# EAGLE design Step_Down (EAGLE 8.2.2)
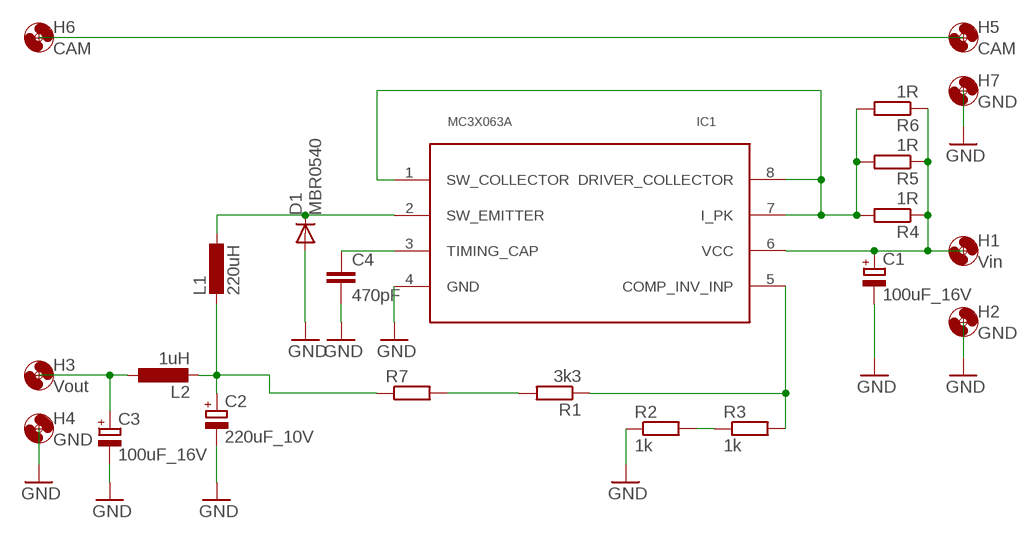
[diagram p0: schematic, sheet 1]

## Parts
C1  100uF_16V  CPOL-EUD/7343-31W  [D/7343-31W]
C2  220uF_10V  CPOL-EUD/7343-31W  [D/7343-31W]
C3  100uF_16V  CPOL-EUD/7343-31W  [D/7343-31W]
C4  470pF  C-EUC0805K  [C0805K]
D1  MBR0540  CGRM4001-G  [SOD-123_MINI-SMA]
H1  Vin  MOUNT-HOLE2.8  [2,8]
H2  GND  MOUNT-HOLE2.8  [2,8]
H3  Vout  MOUNT-HOLE2.8  [2,8]
H4  GND  MOUNT-HOLE2.8  [2,8]
H5  CAM  MOUNT-HOLE2.8  [2,8]
H6  CAM  MOUNT-HOLE2.8  [2,8]
H7  GND  MOUNT-HOLE2.8  [2,8]
IC1  MC3X063A  [SO08]
L1  220uH  L-SMD-2220  [2220]
L2  1uH  L-EUL1812  [L1812]
R1  3k3  R-EU_R0805  [R0805]
R2  1k  R-EU_R0805  [R0805]
R3  1k  R-EU_R0805  [R0805]
R4  1R  R-EU_R0805  [R0805]
R5  1R  R-EU_R0805  [R0805]
R6  1R  R-EU_R0805  [R0805]
R7  R-EU_R1206W  [R1206W]

## Nets
GND: C1.- C2.- C3.- C4.2 D1.A H2.P$1 H4.P$1 H7.P$1 IC1.4(GND) R2.1
N$1: R2.2 R3.1
N$2: IC1.1(SW_COLLECTOR) IC1.7(I_PK) IC1.8(DRIVER_COLLECTOR) R4.2 R5.2 R6.2
N$3: C1.+ H1.P$1 IC1.6(VCC) R4.1 R5.1 R6.1
N$4: D1.C IC1.2(SW_EMITTER) L1.1
N$5: C4.1 IC1.3(TIMING_CAP)
N$6: C2.+ L1.2 L2.2 R7.1
N$7: H5.P$1 H6.P$1
N$8: IC1.5(COMP_INV_INP) R1.1 R3.2
N$9: C3.+ H3.P$1 L2.1
N$10: R1.2 R7.2

## Library data of the parts
C1-C3 = rcl:CPOL-EU: POLARIZED CAPACITOR, European symbol
C4 = rcl:C-EU: CAPACITOR, European symbol
D1 = diode:CGRM400*-G: Molded plasitc,JEDEC SOD-123/Mini SMA Source: Comchip CGRM4001-G.pdf
H1-H7 = holes:MOUNT-HOLE: MOUNTING HOLE with drill center marker
IC1 = usb:MC3X063A
L1 = usb:L-SMD
L2 = rcl:L-EU: INDUCTOR, European symbol
R1-R7 = rcl:R-EU_: RESISTOR, European symbol

## Board
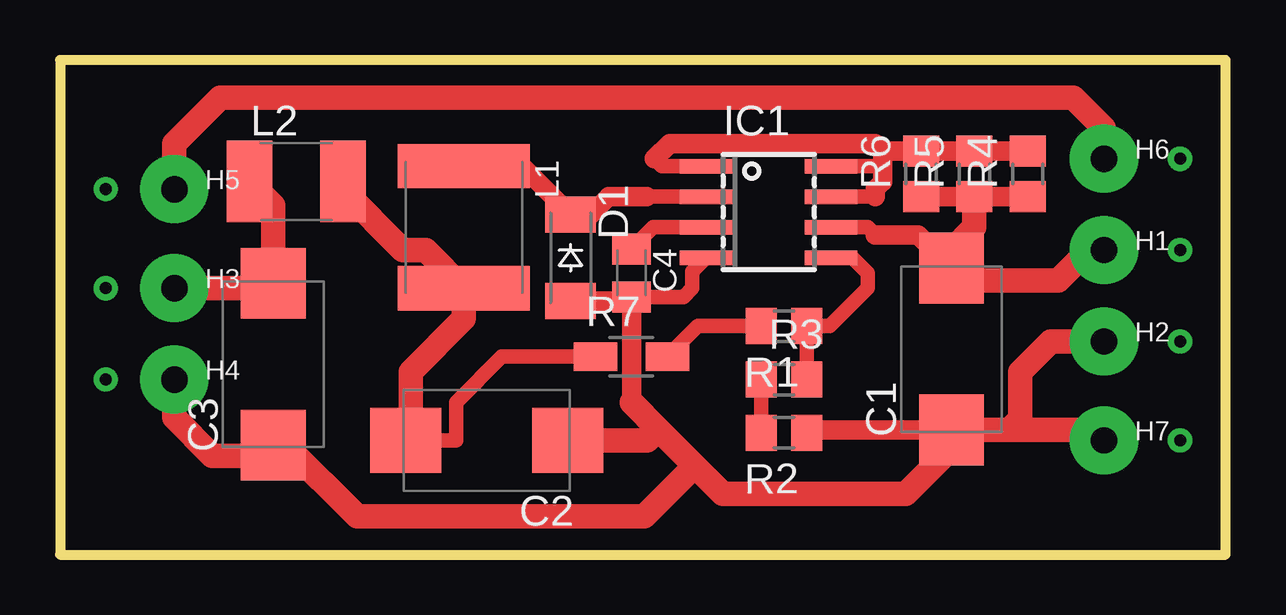
[diagram p1: board, top side]

Size 48.56 x 20.63 mm. Coordinates in mm from the lower left corner, seen from the top.
Outline: 0,0 48.56,0 48.56,20.63 0,20.63 0,0
Copper layers (1*16): Top 0.035mm / dielectric 1.5mm / Bottom 0.035mm
Design rules "default": minimum track width 6mil, minimum drill 0.35mm, track to track 6mil, track to pad 6mil, pad to pad 6mil, via to via 6mil, smd to smd 6mil, copper to edge 40mil, drill to drill 6mil, minimum pad ring 10mil, minimum via ring 8mil, stop-mask expansion 4mil, vias tented up to drill 0mil, thermal gap 10mil

### Footprints (pad centres in the part's own frame; a part is rotated, then mirrored left to right if it is on the bottom)
D/7343-31W = smd 2.95 x 2.7: + 3.375,0; - -3.375,0
C0805K = smd 1.3 x 1.6: 1 -1,0; 2 1,0
SOD-123_MINI-SMA = smd 1.5 x 2.1: A 1.8,0; C -1.8,0
2,8 = drill 1.1 pad 2.845: P$1 0,0
SO08 = smd 0.6 x 2.2: 1 -1.905,-2.6; 2 -0.635,-2.6; 3 0.635,-2.6; 4 1.905,-2.6; 5 1.905,2.6; 6 0.635,2.6; 7 -0.635,2.6; 8 -1.905,2.6
2220 = smd 1.85 x 5.5: 1 -2.55,0; 2 2.55,0
L1812 = smd 1.9 x 3.4: 1 -1.95,0; 2 1.95,0
R0805 = smd 1.3 x 1.5: 1 -0.95,0; 2 0.95,0
R1206W = smd 1.8 x 1.2: 1 -1.499,0; 2 1.499,0

### Placement (x,y rotation side)
C1  37.15,8.57 90 top
C2  17.78,4.76 180 top
C3  8.89,7.94 90 top
C4  23.81,11.75 270 top
D1  21.27,12.38 270 top
H1  43.5,12.7 0 top
H2  43.5,8.89 0 top
H3  4.76,11.11 0 top
H4  4.76,7.3 0 top
H5  4.76,15.24 0 top
H6  43.5,16.51 0 top
H7  43.5,4.76 0 top
IC1  29.53,14.29 270 top
L1  16.83,13.65 270 top
L2  9.84,15.56 0 top
R1  30.16,9.53 180 top
R2  30.16,5.08 180 top
R3  30.16,7.3 0 top
R4  40.32,15.88 90 top
R5  38.1,15.88 90 top
R6  35.88,15.88 90 top
R7  23.81,8.26 0 top

### Tracks (layer width: path | path; a pad name or v marks a point on that pad's centre or on a via)
GND
  Top 0.61: C4.2 25.99,10.75 26.35,11.11 26.35,11.81 IC1.4 | 37.03,5.08 C1.-
  Top 0.813: C1.- 31.23,5.2 R2.1 | 23.81,6.35 C4.2 23.65,10.58 D1.A
  Top 1.016: 26.46,3.71 24.94,5.22 | 26.46,3.71 27.62,2.54 35.24,2.54 37.15,4.45 C1.- 39.55,5.2 | 24.94,5.22 23.81,6.35 | C2.- 24.47,4.76 24.94,5.22 | 26.46,3.71 24.34,1.59 12.38,1.59 9.41,4.56 C3.- 8.46,4.13 6.35,4.13 4.76,5.71 H4.P$1 | 39.55,5.2 43.06,5.2 H7.P$1 | H2.P$1 41.27,8.89 40.01,7.62 40.01,5.65 39.55,5.2
N$1
  Top 0.61: R3.1 R2.2
N$2
  Top 0.61: IC1.7 33.97,14.92 | 24.77,16.51 25.08,16.19 IC1.1 | IC1.8 34.23,16.19 34.29,16.13
  Top 0.813: 33.97,14.92 33.97,15.24 34.29,15.56 34.29,16.13 34.29,16.62 | 34.29,16.62 34.29,16.83 33.97,17.14 25.4,17.14 24.77,16.51 | R4.2 R5.2 R6.2 34.49,16.82 34.29,16.62
N$3
  Top 0.61: IC1.6 33.66,13.65 33.97,13.34
  Top 0.813: 33.97,13.34 35.76,13.34 C1.+ 37.15,13.02 | R5.1 R6.1 | R5.1 R4.1 | R5.1 38.1,14.61
  Top 1.016: R5.1 38.1,13.65 37.15,12.7 C1.+ 37.66,11.43 41.59,11.43 42.86,12.7 H1.P$1
N$4
  Top 0.61: 24.45,14.92 IC1.2
  Top 0.813: L1.1 19.25,16.2 D1.C 22.12,14.18 22.86,14.92 24.45,14.92
N$5
  Top 0.61: IC1.3 24.72,13.65 C4.1
N$6
  Top 0.61: R7.1 18.41,8.26 16.51,6.35 16.51,4.76 14.8,4.76 14.61,4.96
  Top 1.016: C2.+ 14.61,4.96 14.61,7.62 16.83,9.84 L1.2 15.23,12.7 14.29,12.7 11.79,15.2 L2.2
N$7
  Top 1.016: H6.P$1 43.5,17.78 42.23,19.05 6.67,19.05 4.76,17.14 H5.P$1
N$8
  Top 0.61: IC1.5 33.02,12.38 33.66,11.75 33.66,11.11 32.07,9.53 R1.1 R3.2
N$9
  Top 1.016: L2.1 8.89,14.56 C3.+ 8.69,11.11 H3.P$1
N$10
  Top 0.61: R1.2 26.58,9.53 R7.2
N$11  (via drill 0.5 pad 1.02)
  other vias: 1.91,15.24
N$12  (via drill 0.5 pad 1.02)
  other vias: 1.91,11.11
N$13  (via drill 0.5 pad 1.02)
  other vias: 1.91,7.3
N$14  (via drill 0.5 pad 1.02)
  other vias: 46.67,16.51
N$15  (via drill 0.5 pad 1.02)
  other vias: 46.67,12.7
N$16  (via drill 0.5 pad 1.02)
  other vias: 46.67,8.89
N$17  (via drill 0.5 pad 1.02)
  other vias: 46.67,4.76